# EAGLE design simplePDschematicsv1 (EAGLE 7.5.0)
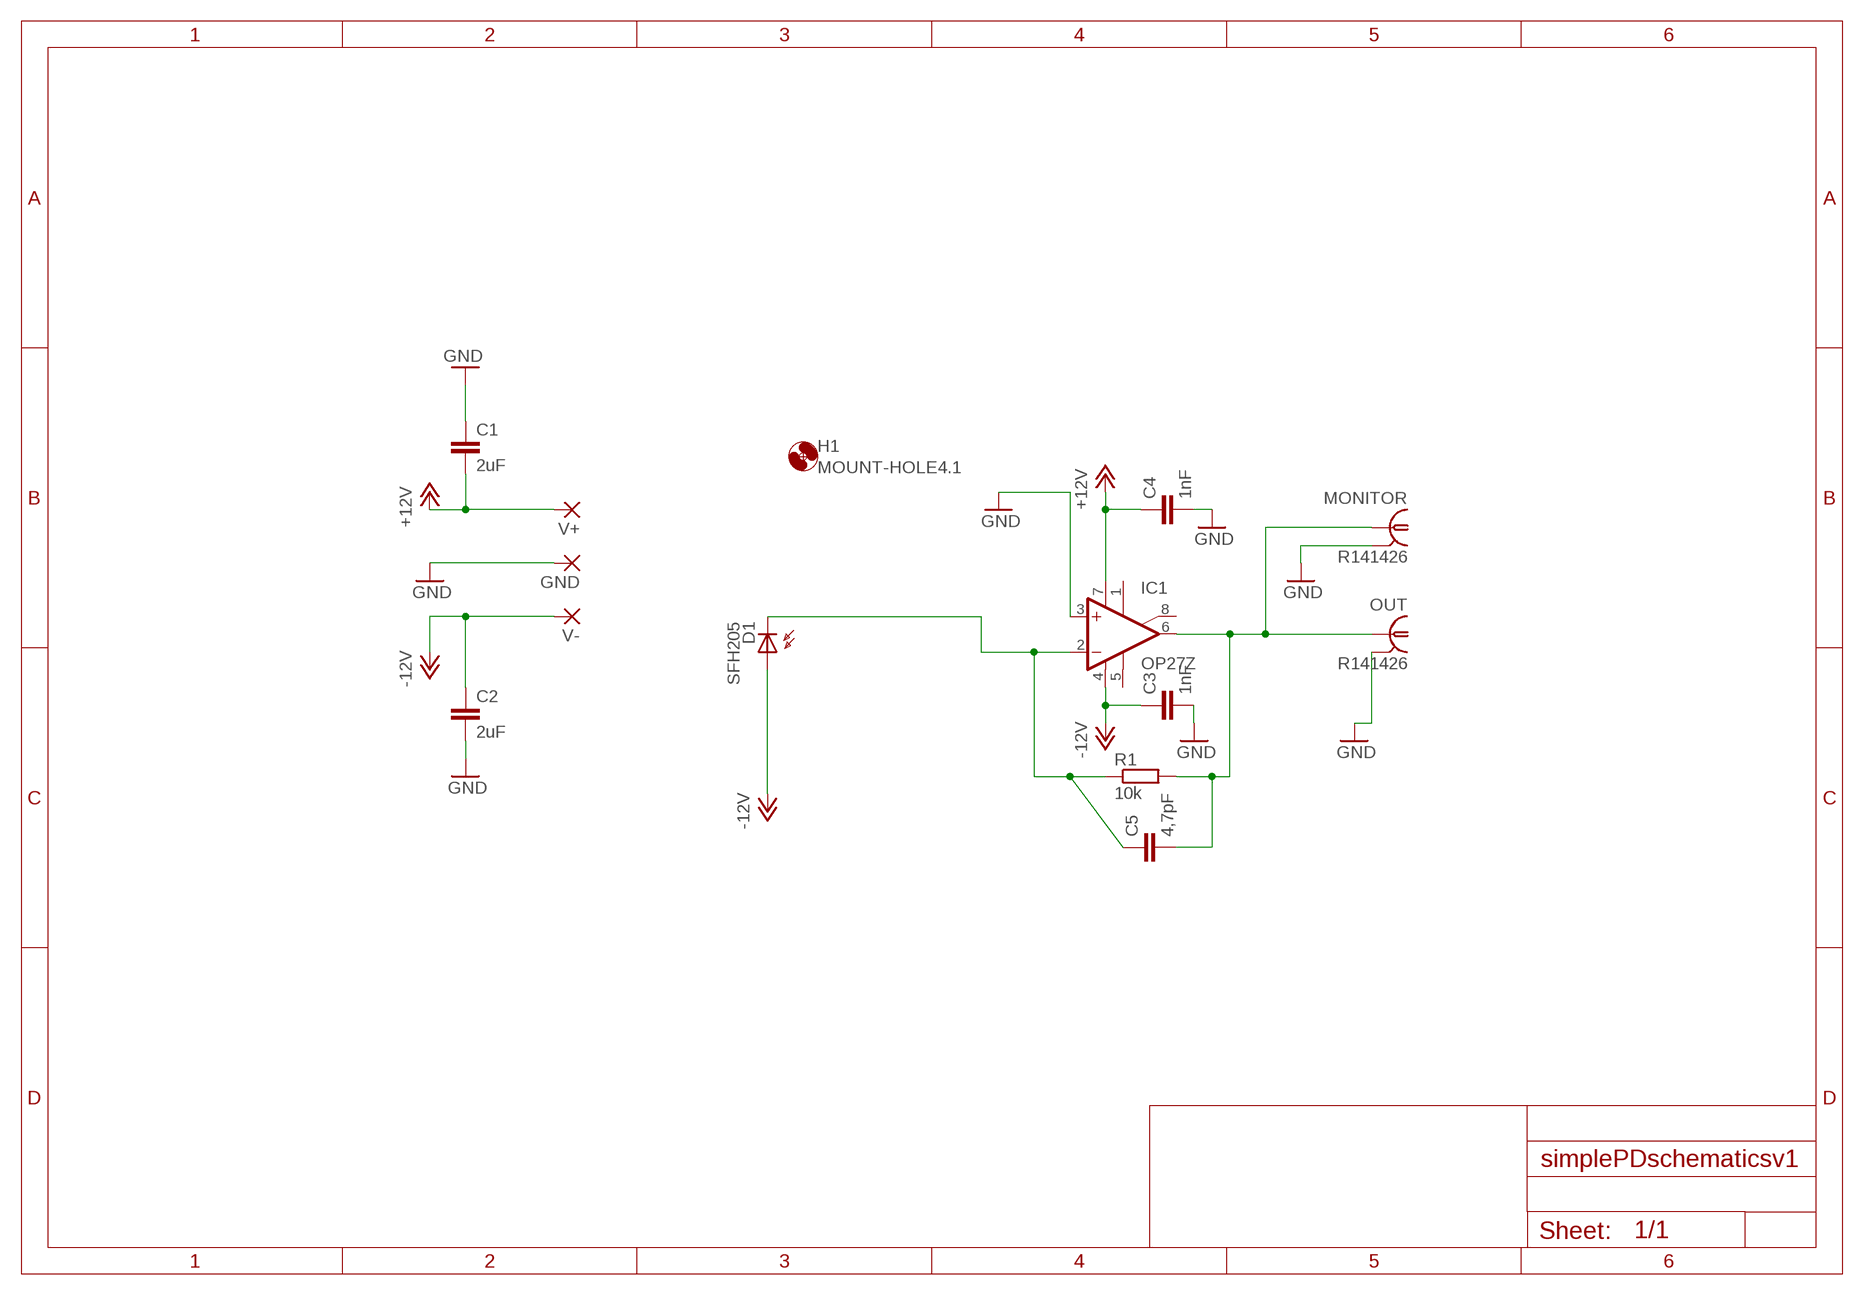
[diagram p0: schematic, sheet 1]

## Parts
C1  2uF  C-EU050-075X075  [C050-075X075]
C2  2uF  C-EU050-075X075  [C050-075X075]
C3  1nF  C-EU025-050X050  [C025-050X050]
C4  1nF  C-EU025-050X050  [C025-050X050]
C5  4,7pF  C-EU025-050X050  [C025-050X050]
D1  SFH205  [SFH205]
GND  1,6/0,9  [1,6/0,9]
H1  MOUNT-HOLE4.1  [4,1]
IC1  OP27Z  [DIL08]
MONITOR  R141426  [R141426]
OUT  R141426  [R141426]
R1  10k  R-EU_0207/10  [0207/10]
V+  1,6/0,9  [1,6/0,9]
V-  1,6/0,9  [1,6/0,9]

## Nets
GND: C1.1 C2.2 C3.2 C4.2 GND.1(P) IC1.3(+IN) MONITOR.2 MONITOR.3 MONITOR.4 MONITOR.5 OUT.2 OUT.3 OUT.4 OUT.5
N$1: C5.1 D1.K(C) IC1.2(-IN) R1.1
N$2: C5.2 IC1.6(OUT) MONITOR.1 OUT.1 R1.2
V+: C1.2 C4.1 IC1.7(V+) V+.1(P) ; supply symbol labelled +12V
V-: C2.1 C3.1 D1.A IC1.4(V-) V-.1(P) ; supply symbol labelled -12V
Unconnected: IC1.1(ON1) IC1.5(OPT) IC1.8(ON2)

## Library data of the parts
C1-C5 = resistor:C-EU: CAPACITOR, European symbol
D1 = opto-trans-siemens:SFH205: PHOTO DIODE; OC_FARNELL: unknown; OC_NEWARK: unknown
GND V+ V- = wirepad:1,6/0,9: THROUGH-HOLE PAD
H1 = holes:MOUNT-HOLE: MOUNTING HOLE with drill center marker
IC1 = linear:OP27: OP AMP
MONITOR OUT = con-coax:R141426: BNC COAX CONNECTOR Radiall 50/75 Ohm Spoerle; MF: FARNELL; MPN: R141426161; OC_FARNELL: 4195115; OC_NEWARK: 14J7919
R1 = resistor:R-EU_: RESISTOR, European symbol

## Board
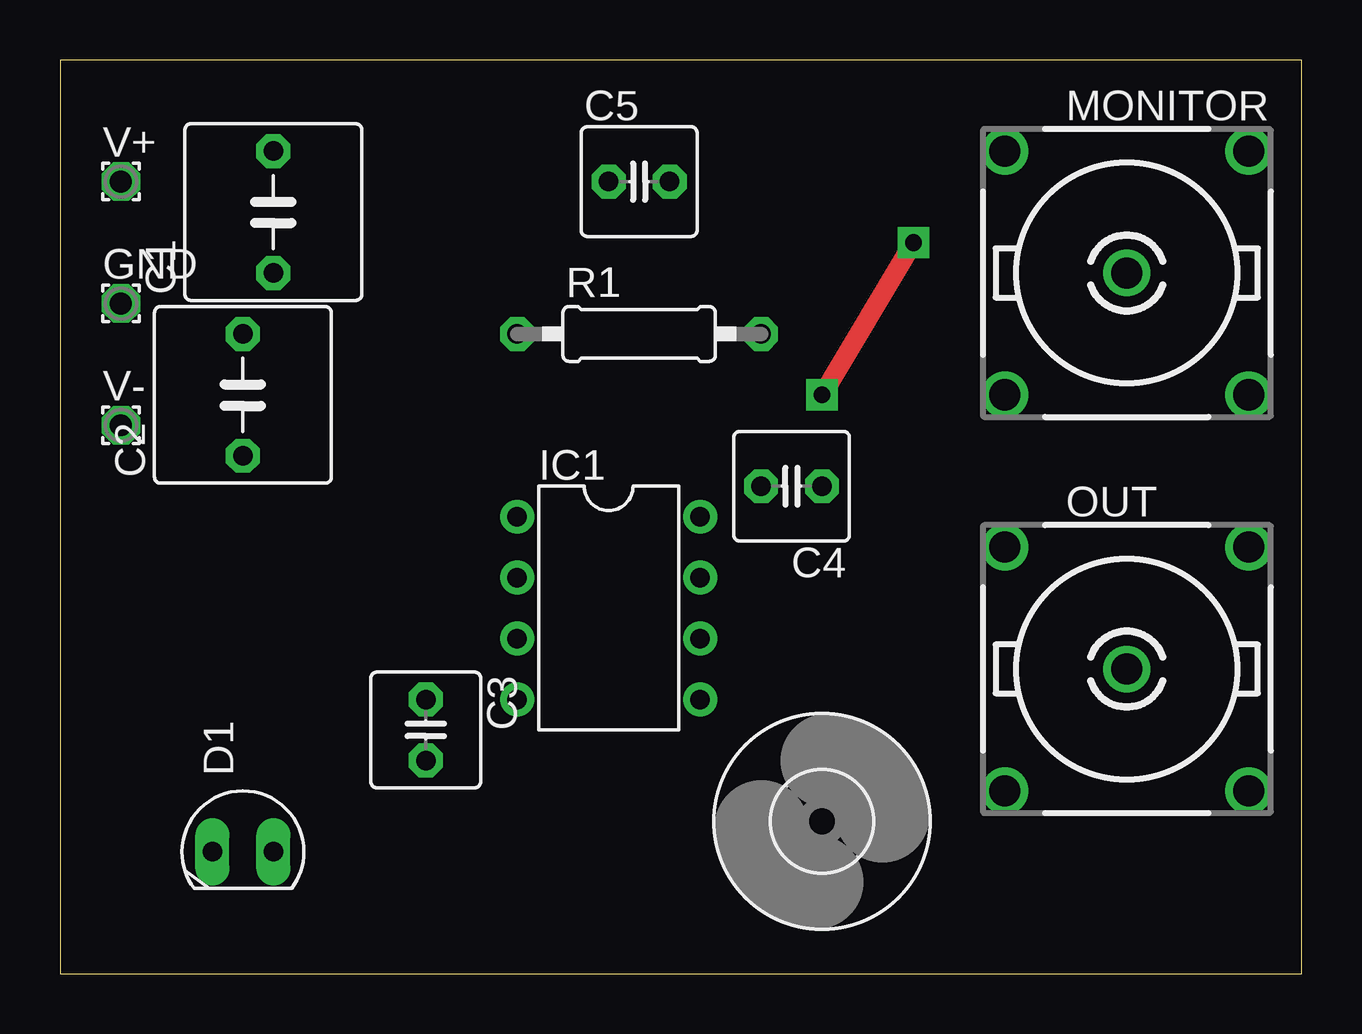
[diagram p1: board, top side]
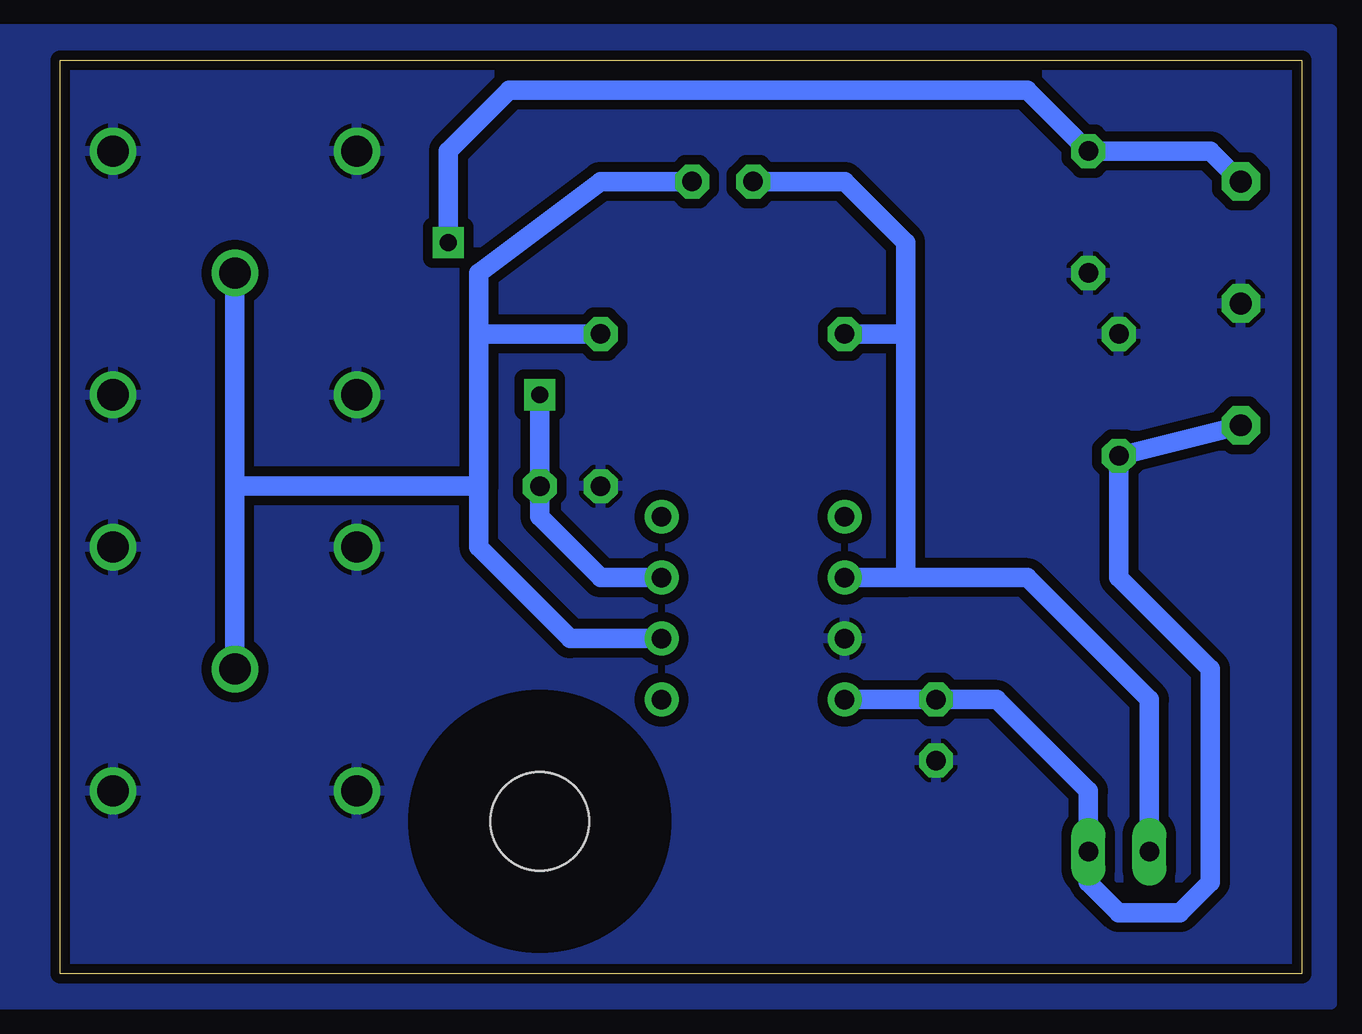
[diagram p2: board, bottom side, seen from below]

Size 51.74 x 38.09 mm. Coordinates in mm from the lower left corner, seen from the top.
Outline: 0,0 51.74,0 51.74,38.09 0,38.09 0,0
Copper layers 16: Bottom 0.035mm
Design rules "eC_1Layer_PClass6_BaseCopperO35_eCDefault": minimum track width 0.15mm, minimum drill 0.35mm, track to track 0.15mm, track to pad 0.15mm, pad to pad 0.15mm, via to via 0.15mm, smd to smd 0mil, copper to edge 0.25mm, drill to drill 0.35mm, minimum pad ring 0.3mm, minimum via ring 0.3mm, stop-mask expansion 0mil, vias tented up to drill 0.45mm, thermal gap 0.2mm

### Footprints (pad centres in the part's own frame; a part is rotated, then mirrored left to right if it is on the bottom)
C050-075X075 = drill 0.813 octagon: 1 -2.54,0; 2 2.54,0
C025-050X050 = drill 0.813 octagon: 1 -1.27,0; 2 1.27,0
SFH205 = drill 0.813 long: A 0,-1.27; K 0,1.27
1,6/0,9 = drill 0.914 pad 1.6 octagon: 1 0,0
4,1 = hole 4.1: 0,0
DIL08 = drill 0.813 pad 1.27: 1 -3.81,-3.81; 2 -1.27,-3.81; 3 1.27,-3.81; 4 3.81,-3.81; 5 3.81,3.81; 6 1.27,3.81; 7 -1.27,3.81; 8 -3.81,3.81
R141426 = drill 1.295: 1 0,0; 2 5.08,5.08; 3 -5.08,5.08; 4 -5.08,-5.08; 5 5.08,-5.08
0207/10 = drill 0.813 octagon: 1 -5.08,0; 2 5.08,0

### Placement (x,y rotation side)
C1  8.89,31.75 90 top
C2  7.62,24.13 90 top
C3  15.24,10.16 270 top
C4  30.48,20.32 180 top
C5  24.13,33.02 0 top
D1  7.62,5.08 90 top
GND  2.54,27.94 0 top
H1  31.75,6.35 0 top
IC1  22.86,15.24 270 top
MONITOR  44.45,29.21 0 top
OUT  44.45,12.7 0 top
R1  24.13,26.67 0 top
V+  2.54,33.02 0 top
V-  2.54,22.86 0 top

### Tracks (layer width: path | path; a pad name or v marks a point on that pad's centre or on a via)
GND
  pour Bottom (isolate 0.406): -1.27,39.37 55.88,39.37 55.88,-1.27 -1.27,-1.27
N$1
  Bottom 0.813: 16.51,26.67 R1.1 | 16.51,26.67 16.51,30.48 19.05,33.02 C5.1 | D1.K 6.35,11.43 11.43,16.51 16.51,16.51 | IC1.2 16.51,16.51 | 16.51,16.51 16.51,26.67
N$2
  Bottom 0.813: IC1.6 30.48,13.97 34.29,17.78 34.29,20.32 | 34.29,20.32 44.45,20.32 | 44.45,20.32 MONITOR.1 | OUT.1 44.45,20.32 | C5.2 29.21,33.02 34.29,29.21 34.29,26.67 | 34.29,26.67 34.29,20.32 | R1.2 34.29,26.67
V+  (via drill 0.7 pad 0.81)
  Top 0.813: v35.56,30.48 v31.75,24.13
  Bottom 0.813: V+.1 3.81,34.29 C1.2 11.43,36.83 33.02,36.83 35.56,34.29 v35.56,30.48 | v31.75,24.13 C4.1 31.75,19.05 29.21,16.51 IC1.7
V-
  Bottom 0.813: IC1.4 C3.1 12.7,11.43 8.89,7.62 D1.A 8.89,3.81 7.62,2.54 5.08,2.54 3.81,3.81 3.81,12.7 7.62,16.51 C2.1 V-.1